# Altium project AND_PRJ.PrjPcb
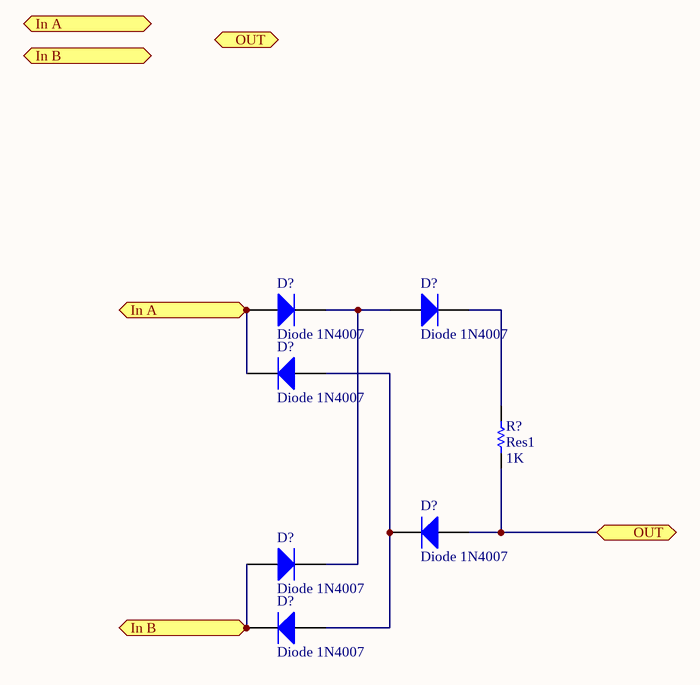
[diagram p0: AND SCH.SchDoc]
1 sheet, 7 parts. Net scope: flat (ports and power ports of the same name join across sheets).

## Sheet AND SCH.SchDoc
size A

### Parts
(Parts that share a designator on the sheet are numbered #1, #2 ... from top to bottom, then left to right.)
D?#1  Diode 1N4007  [DO-41]
D?#2  Diode 1N4007  [DO-41]
D?#3  Diode 1N4007  [DO-41]
D?#4  Diode 1N4007  [DO-41]
D?#5  Diode 1N4007  [DO-41]
D?#6  Diode 1N4007  [DO-41]
R?  Res1  value 1K  [AXIAL-0.3]

### Ports
In A, In B, OUT

### Nets
NetD?#1_1: D?#1.1(A) D?#3.2(K) ; port In A
NetD?#1_2: D?#1.2(K) D?#2.1(A) D?#4.2(K)
NetD?#2_2: D?#2.2(K) R?.2
NetD?#3_1: D?#3.1(A) D?#5.2(K) D?#6.1(A)
NetD?#4_1: D?#4.1(A) D?#6.2(K) ; port In B
NetD?#5_1: D?#5.1(A) R?.1 ; port OUT

### Library data of the parts
D?#1-D?#6 = Diode 1N4007: 1 Amp General Purpose Rectifier; Published: 8-Jun-2000; LatestRevisionDate: 17-Jul-2002; LatestRevisionNote: Re-released for DXP Platform.; DatasheetVersion: 1998; PackageVersion: Aug-1999; PackageReference: DO-41; Publisher: Altium Limited; PackageDescription: Diode, Axial; Body 5.2 x 2.7 mm (LxDia. max), Lead Dia. 0.86 mm (max); Code_JEDEC: DO-204-AL; ComponentLink1Description: Manufacturer Link; ComponentLink1URL: http://www.fairchildsemi.com/; ComponentLink2Description: Datasheet; ComponentLink2URL: http://www.fairchildsemi.com/ds/1N%2F1N4001.pdf
R? = Res1: Resistor; Published: 8-Jun-2000; LatestRevisionDate: 17-Jul-2002; LatestRevisionNote: Re-released for DXP Platform.; PackageReference: AXIAL-0.3; Publisher: Altium Limited; PackageDescription: Axial Device, Thru-Hole; 2 Leads; 0.3 in Pin Spacing